# Altium schematic sheet panel_IO.SchDoc
size A4
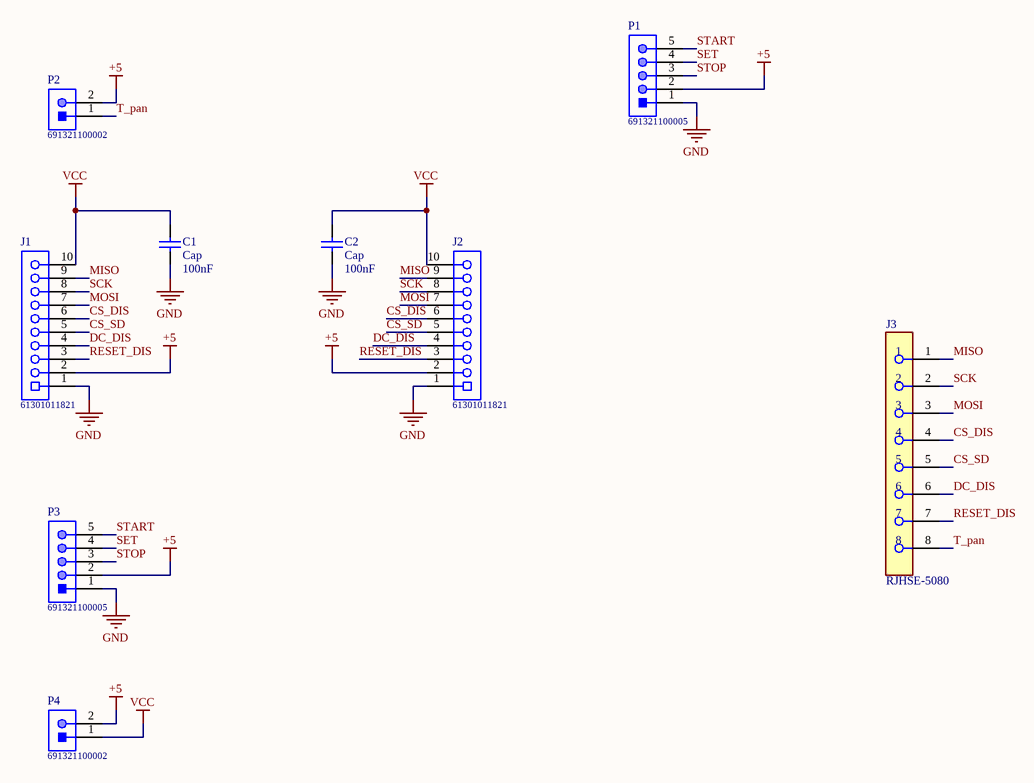
[diagram p0: panel_IO.SchDoc]

## Parts
C1  Cap  value 100nF  [RAD-0.3]
C2  Cap  value 100nF  [RAD-0.3]
J1  61301011821  [61301011821]
J2  61301011821  [61301011821]
J3  RJHSE-5080  [FP-RJHSE-5080-MFG]
P1  691321100005  [691321100005]
P2  691321100002  [691321100002]
P3  691321100005  [691321100005]
P4  691321100002  [691321100002]

## Nets
+5: J1.2 J2.2 P1.2 P2.2 P3.2 P4.2
GND: C1.1 C2.1 J1.1 J2.1 P1.1 P3.1
VCC: C1.2 C2.2 J1.10 J2.10 P4.1
CS_DIS: J1.6 J2.6 J3.4
CS_SD: J1.5 J2.5 J3.5
DC_DIS: J1.4 J2.4 J3.6
MISO: J1.9 J2.9 J3.1
MOSI: J1.7 J2.7 J3.3
RESET_DIS: J1.3 J2.3 J3.7
SCK: J1.8 J2.8 J3.2
SET: P1.4 P3.4
START: P1.5 P3.5
STOP: P1.3 P3.3
T_pan: J3.8 P2.1

## Library data of the parts
C1 C2 = Cap: Capacitor; Published: 8-Jun-2000; LatestRevisionDate: 17-Jul-2002; LatestRevisionNote: Re-released for DXP Platform.; PackageReference: RAD-0.3; Publisher: Altium Limited; PackageDescription: Radial Cap, Thru-Hole; 2 Leads; 0.3 in Pin Spacing
J1 J2 = CMP-1502-01332-1: THT Vertical Socket Header WR-PHD, Pitch 2.54 mm, Single Row, 10 pins; Manufacturer: Wurth Elektronik; Rated Current: 3A; Working Voltage: 250VAC; Gender: Female; Pitch: 2.54mm; Contact Resistance: 20mOhm; Pin Number: 10; Withstanding Voltage: 500VAC; Publisher: WurthElektronik; Orientation: Vertical; Row Number: Single; Package Reference: 61301011821; Packaging: Tray; Datasheet URL: https://katalog.we-online.de/em/datasheet/6130xx11821.pdf; Operating Temperature: -40to125degC; Part Number: 61301011821; Manufacturer URL: http://www.we-online.de; Mounting Technology: THT
J3 = CMP-02366-000003-1: CONN MOD JACK 8P8C R/A UNSHLD; Manufacturer: Amphenol; Current Rating: 1.5A; Voltage Rating: 125V; Pitch: 1.02mm; Conn Orientation: Right Angle; Number Of Contacts: 8; Is Female: yes; Conn Gender: Female; Lead Free: Yes; Device Class L3: unset; Footprint Url: https://cdn.amphenol-icc.com/media/wysiwyg/files/drawing/rjhse5080.pdf?__cf_chl_jschl_tk__=e349db0bbbb6188a39347cd5e541b92fa02c9719-1587748343-0-AW7tChdeHzRPLX9gSWj7WrKaXQoY9BsmT9Ek0h-T62M9y3Rs9iypFcOtkzb-6sGYQEjFE-jcoNciDETCOZrh1rYyOesac5SvYLoLwHIsHvF4AKBlx-MXmfZUVk9OTTJLqyQq2qMm0PFRLJpNcK0nrKResqOniRSYixG2sPTmOPraH-ULJFBDL602CHqcI9KKBgTq90Jh1OL2Td4moJ99rFsJRJ1Tk_uoxGe8ublcP_ARu-uLpWcQrBcwOcHDTAwL29DAwVaqcH7ta8Ks7WMlHmVl_pILeEDwT0bE9vu5Pa5S3PtNRF1leuFkgi_FMbUxTDulc5xzbXSfng8srUIV1lWXny5nx1fZJEUa_w97yKjffzBMxiWLWVN-V7-uqAaPbyv_m-wRyw5O25OZNyJOeGU; ComponentLink2URL: https://cdn.amphenol-icc.com/media/wysiwyg/files/documentation/datasheet/inputoutput/io-modjack-rjhse.pdf; Device Class L1: Connectors; Package: CONN_MOD_JACK; Mouser Description: Modular Connectors / Ethernet Connectors R/A RJ45 NONSHIELDED 8 CONT NO LEDS; Manufacturer Part Number: RJHSE-5080; Octopart: https://octopart.com/rjhse-5080-amphenol-45060; Category: Conn; Height: 0.535inch; Temperature: -55°C to +85°C; Digikey Description: CONN MOD JACK 8P8C R/A UNSHLD; Device Class L2: Modular / Ethernet Connectors; Contact Material: Gold,Nickel; ComponentLink2Description: Datasheet; Temperature Range Low: -55°C; RoHS: TRUE; Automotive: No; Temperature Range High: +85°C
P1 P3 = CMP-1502-01786-1: Serie 3211 - 3.50mm Vertical PCB Header WR-TBL, 5 pin; Manufacturer: Wurth Elektronik; Pin Number: 5; Gender: Male; Datasheet URL: http://katalog.we-online.de/em/datasheet/6913211000xx.pdf; Package Reference: 691321100005; Manufacturer URL: http://www.we-online.de; Pitch: 3.50mm; Operating Temperature: -40to105degC; Publisher: WurthElektronik; Packaging: Box; Part Number: 691321100005; Mounting Technology: THT
P2 P4 = CMP-1502-01783-1: Serie 3211 - 3.50mm Vertical PCB Header WR-TBL, 2 pin; Manufacturer: Wurth Elektronik; Gender: Male; Pin Number: 2; Part Number: 691321100002; Mounting Technology: THT; Manufacturer URL: http://www.we-online.de; Datasheet URL: http://katalog.we-online.de/em/datasheet/6913211000xx.pdf; Packaging: Box; Package Reference: 691321100002; Publisher: WurthElektronik; Pitch: 3.50mm; Operating Temperature: -40to105degC